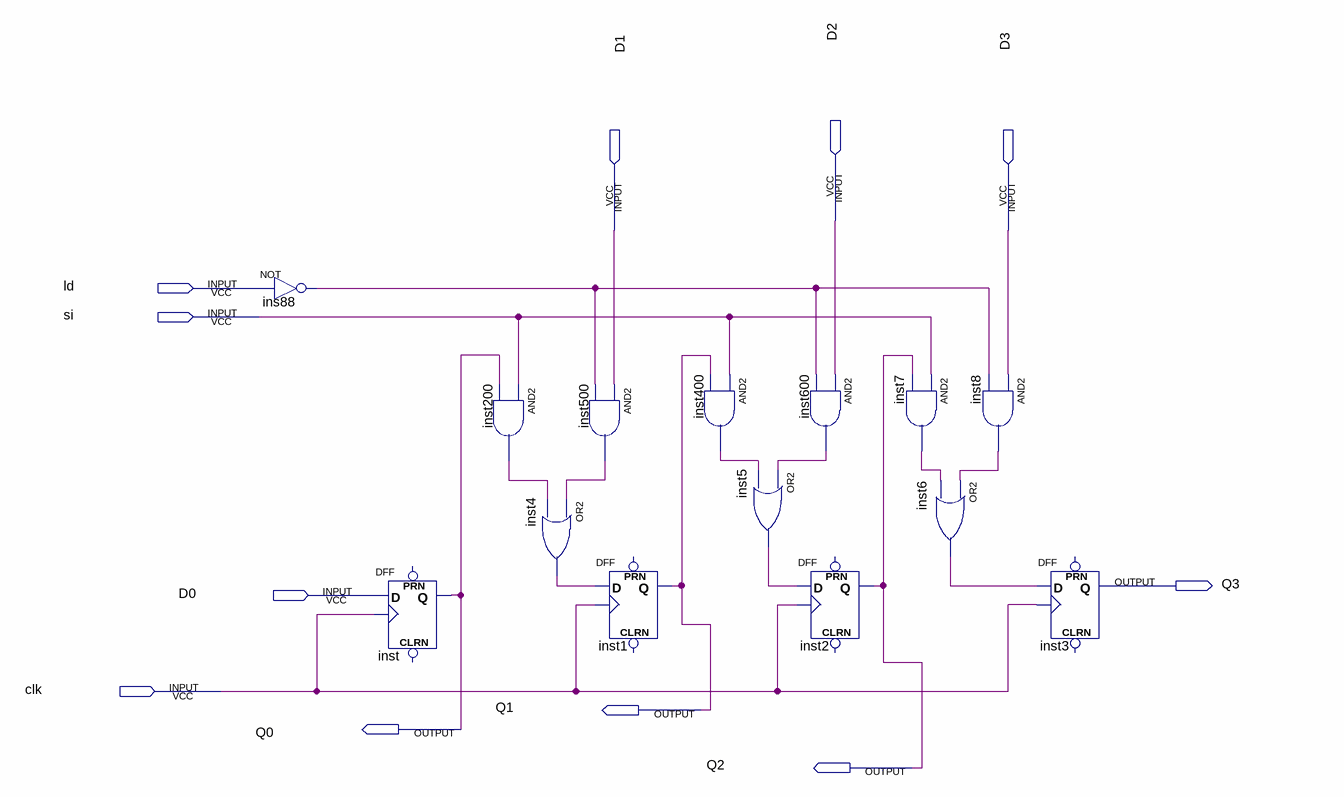
[diagram p0: schematic sheet]
// Quartus schematic ShiftReg4.bdf as structural Verilog: 14 symbols, 11 pins
module ShiftReg4 (
  input  D2,
  input  D1,
  input  D3,
  input  ld,
  input  si,
  input  D0,
  input  clk,
  output Q3,
  output Q1,
  output Q0,
  output Q2
);

  wire ins88_out, inst4_out, inst5_out, inst6_out, inst7_out, inst8_out, inst200_out, inst400_out,
       inst500_out, inst600_out;

  not ins88 (ins88_out, ld);
  DFF inst (.CLK(clk), .D(D0), .Q(Q0));  // open: CLRN, PRN
  and inst200 (inst200_out, si, Q0);
  or inst4 (inst4_out, inst500_out, inst200_out);
  and inst500 (inst500_out, D1, ins88_out);
  DFF inst1 (.CLK(clk), .D(inst4_out), .Q(Q1));  // open: CLRN, PRN
  and inst400 (inst400_out, si, Q1);
  or inst5 (inst5_out, inst600_out, inst400_out);
  and inst600 (inst600_out, D2, ins88_out);
  DFF inst2 (.CLK(clk), .D(inst5_out), .Q(Q2));  // open: CLRN, PRN
  and inst7 (inst7_out, si, Q2);
  or inst6 (inst6_out, inst8_out, inst7_out);
  and inst8 (inst8_out, D3, ins88_out);
  DFF inst3 (.CLK(clk), .D(inst6_out), .Q(Q3));  // open: CLRN, PRN
endmodule
